# Altium schematic sheet POWER.SchDoc
size B
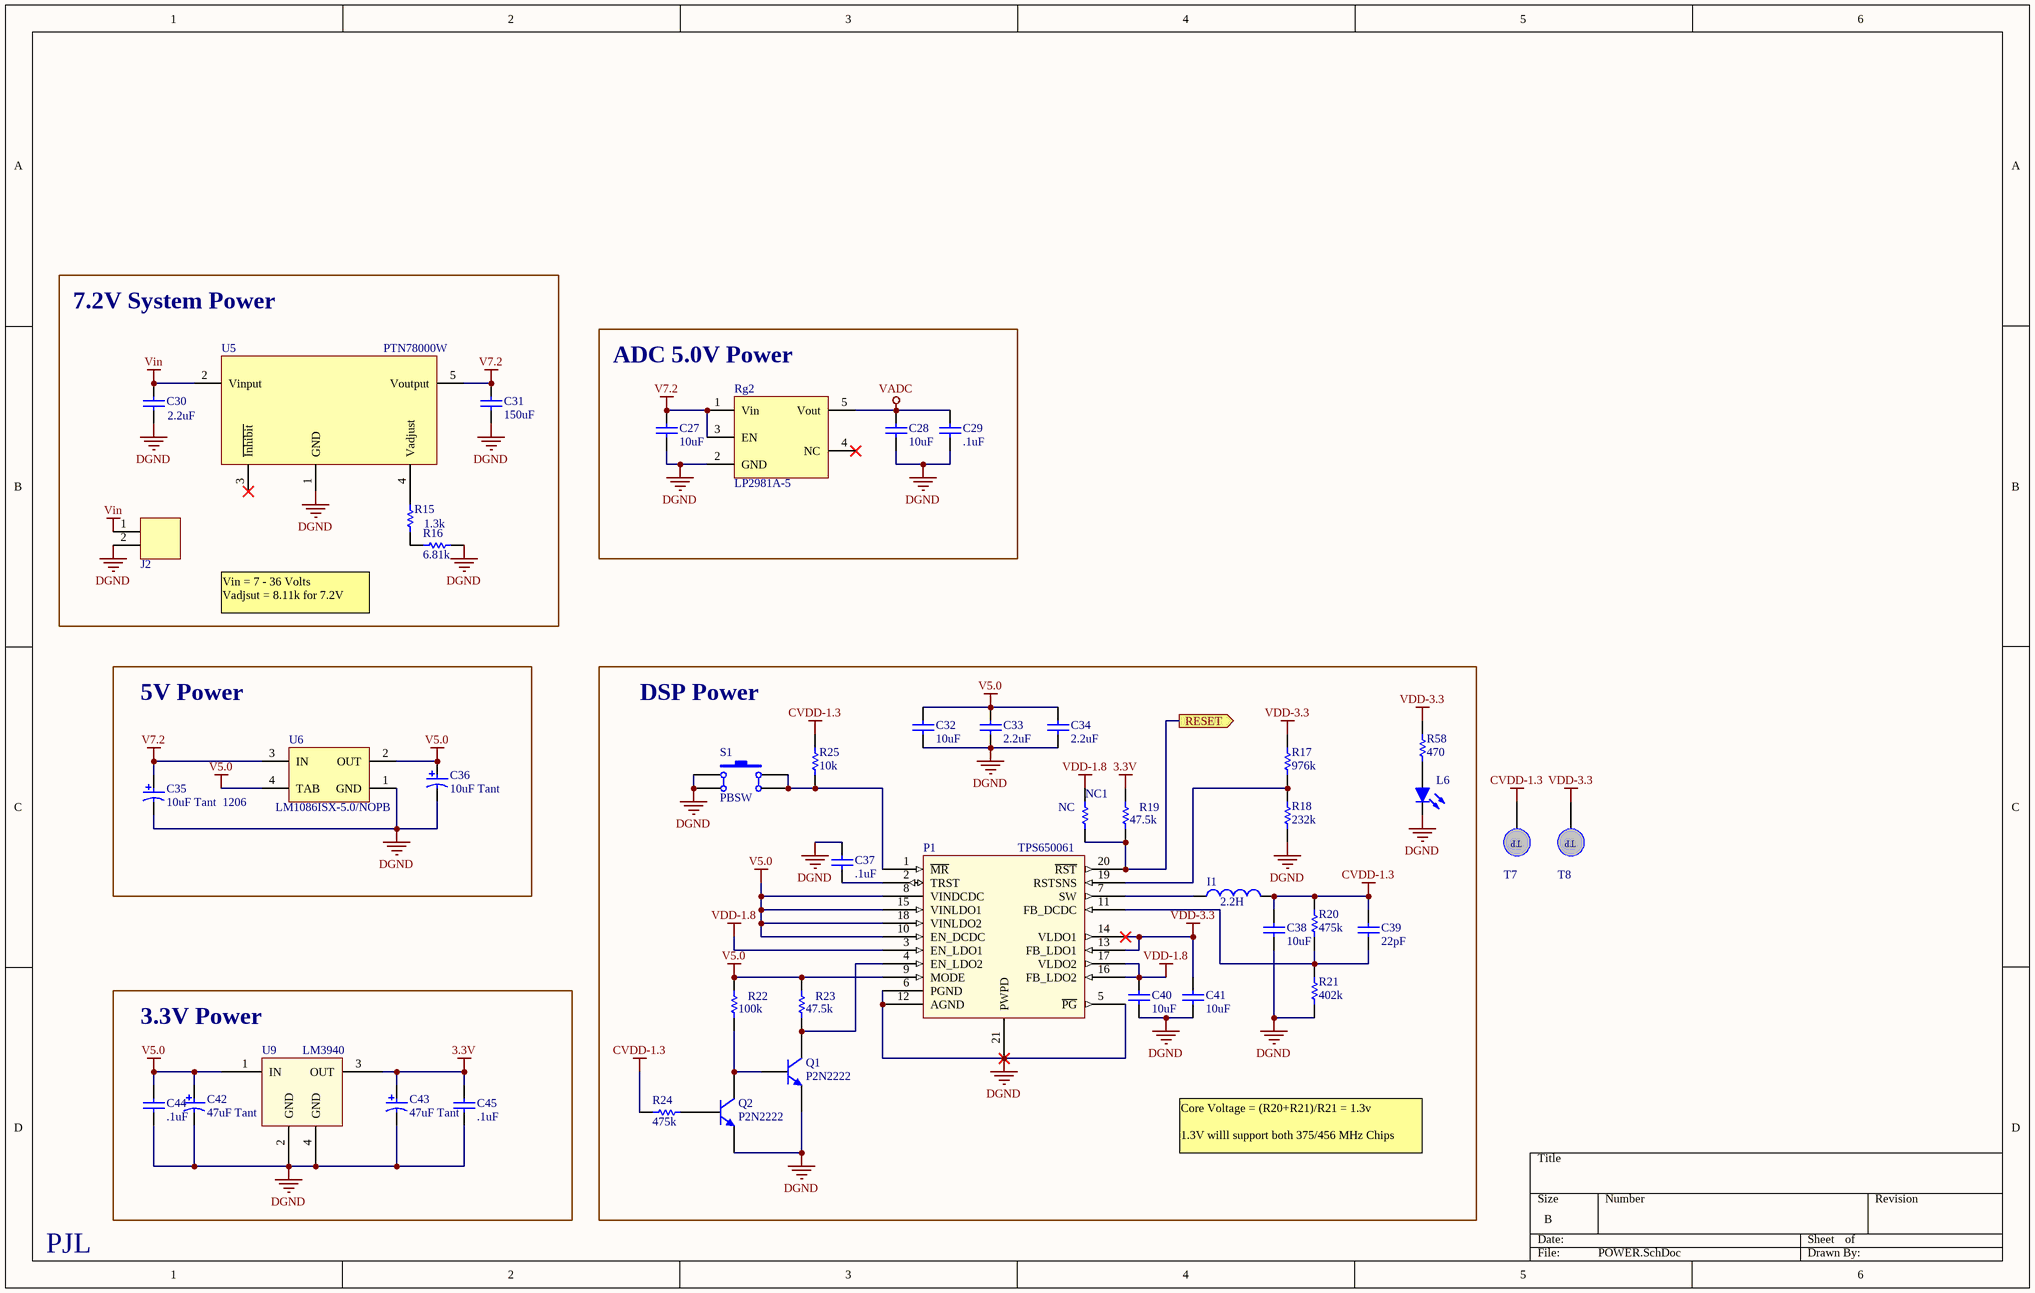
[diagram p0: POWER.SchDoc]

## Parts
C27  10uF  [CAPC2012XL]
C28  10uF  [CAPC2012XL]
C29  .1uF  [CAPC1608XN]
C30  2.2uF  [CAPC2012XL]
C31  150uF  [CAPPR2.5-6.3x11]
C32  10uF  [CAPC2012XL]
C33  2.2uF  [CAPC1608XN]
C34  2.2uF  [CAPC1608XN]
C35  10uF Tant  1206  [CAPMP3216XN]
C36  10uF Tant  [CAPMP2012XL]
C37  .1uF  [CAPC1608XN]
C38  10uF  [CAPC2012XL]
C39  22pF  [CAPC1608XN]
C40  10uF  [CAPC2012XL]
C41  10uF  [CAPC2012XL]
C42  47uF Tant  [CAPMP2012XL]
C43  47uF Tant  [CAPMP2012XL]
C44  .1uF  [CAPC1608XN]
C45  .1uF  [CAPC1608XN]
I1  2.2H  [LPS3015]
J2  2-pin Horz Sherlock  [MOLEX-HDR-1X2-SHERLOCK-HORZ]  (value not drawn)
L6  LED-GREEN  [LED0805-GREEN]  (value not drawn)
NC1  NC  [RESC1608XN]
P1  TPS650061  [QFN4-20N]
Q1  P2N2222  [TO-92A]
Q2  P2N2222  [TO-92A]
R15  1.3k  [RESC1608XL]
R16  6.81k  [RESC1608XL]
R17  976k  [RESC1608XL]
R18  232k  [RESC1608XL]
R19  47.5k  [RESC1608XN]
R20  475k  [RESC1608XL]
R21  402k  [RESC1608XL]
R22  100k  [RESC1608XL]
R23  47.5k  [RESC1608XN]
R24  475k  [RESC1608XL]
R25  10k  [RESC1608XL]
R58  470  [RESC1608XN]
Rg2  LP2981A-5  [TI-SOT-23_5N]
S1  PBSW  [PBSW]
T7  TEST MINI  [TEST-POINT - 5015]  (value not drawn)
T8  TEST MINI  [TEST-POINT - 5015]  (value not drawn)
U5  PTN78000W  [TI-EUS - 3d]
U6  LM1086ISX-5.0/NOPB  [TO263]
U9  LM3940  [SOT230P700X155-4N]

## Blocks framed on the sheet
7.2V System Power: C30 C31 J2 R15 R16 U5
ADC 5.0V Power: C27-C29 Rg2
5V Power: C35 C36 U6
DSP Power: C32-C34 C37-C41 I1 L6 NC1 P1 Q1 Q2 R17-R25 R58 S1
3.3V Power: C42-C45 U9

## Ports
RESET (out)

## Nets
3.3V: C43.1 C45.2 R19.2 U9.3(OUT)
CVDD-1.3: C38.2 C39.2 I1.2 R20.2 R24.2 R25.2 T7.1
DGND: C27.1 C28.1 C29.1 C30.1 C31.2 C32.1 C33.1 C34.1 C35.2 C36.2 C37.2 C38.1 C40.1 C41.1 C42.2 C43.2 C44.1 C45.1 J2.2 L6.1(K) P1.5(~{PG}) P1.6(PGND) P1.12(AGND) P1.21(PWPD) Q1.3(E) Q2.3(E) R16.1 R18.2 R21.2 Rg2.2(GND) S1.1(A) S1.2(A') U5.1(GND) U6.1(GND) U9.2(GND) U9.4(GND)
V5.0: C32.2 C33.2 C34.2 C36.1 C42.1 C44.2 P1.8(VINDCDC) P1.9(MODE) P1.10(EN_DCDC) P1.15(VINLDO1) P1.18(VINLDO2) R22.2 R23.2 U6.2(OUT) U6.4(TAB) U9.1(IN)
V7.2: C27.2 C31.1 C35.1 Rg2.1(Vin) Rg2.3(EN) U5.5(Voutput) U6.3(IN)
VADC: C28.2 C29.2 Rg2.5(Vout)
VDD-1.8: C40.2 NC1.2 P1.3(EN_LDO1) P1.16(FB_LDO2) P1.17(VLDO2)
VDD-3.3: C41.2 P1.13(FB_LDO1) P1.14(VLDO1) R17.1 R58.2 T8.1
Vin: C30.2 J2.1 U5.2(Vinput)
RESET: NC1.1 P1.20(~{RST}) R19.1 ; port RESET
NetC37_1: C37.1 P1.2(TRST)
NetC39_1: C39.1 P1.11(FB_DCDC) R20.1 R21.1
NetI1_1: I1.1 P1.7(SW)
NetL6_2: L6.2(A) R58.1
NetP1_1: P1.1(~{MR}) R25.1 S1.3(B) S1.4(B')
NetP1_4: P1.4(EN_LDO2) Q1.1(C) R23.1
NetP1_19: P1.19(RSTSNS) R17.2 R18.1
NetQ1_2: Q1.2(B) Q2.1(C) R22.1
NetQ2_2: Q2.2(B) R24.1
NetR15_1: R15.1 U5.4(Vadjust)
NetR15_2: R15.2 R16.2

Not connected (* = marked no-connect by the designer): Rg2 4(NC)*; U5 3(~{Inhibit})*

## Notes on the sheet
- Vin = 7 - 36 Volts
  Vadjsut = 8.11k for 7.2V
- Core Voltage = (R20+R21)/R21 = 1.3v
  1.3V willl support both 375/456 MHz Chips
- PJL
- (in symbol TEST-POINT) TP

## Library data of the parts
C27 C28 C32 C38 C40 C41 = CAP-CERAMIC-NP: CAP CER 10UF 10V 10% X7R 0805; Manufacturer: Murata Electronics North America; Manufacturer Part Number: GRM21BR71A106KE51L; Capacitance: 10µF; Tolerance: ±10%; Operating Temperature: -55°C ~ 125°C; Supplier Part Number: 490-3905-1-ND; Supplier: Digi-Key; Voltage - Rated: 10V; Package / Case: 0805 (2012 Metric)
C29 C44 C45 = CAP-CERAMIC-NP: CAP CER 0.1UF 10V 20% X7R 0603; Manufacturer Part Number: CX0603MRX7R6BB104; Manufacturer: Yageo; Capacitance: 0.1µF; Applications: Bypass, Decoupling; Operating Temperature: -55°C ~ 125°C; Tolerance: ±20%; Package / Case: 0603 (1608 Metric); Voltage - Rated: 10V; Temperature Coefficient: X7R; Supplier Part Number: 311-1237-1-ND; Supplier: Digi-Key
C30 = Capacitor: Non Polarized Capacitor 2.2uF; Manufacturer: TDK Corporation; Manufacturer Part Number: C2012X5R1H225K; Value: 2.2uF; Supplier: DigiKey; Supplier Part Number: 445-5976-1-ND
C31 = Capacitor: CAP ALUM 150UF 25V 20% RADIAL; Manufacturer: Panasonic Electronic Components; Manufacturer Part Number: EEU-FR1E151; Capacitance: 150µF; Supplier Part Number: P14414-ND; Supplier: Digi-Key; Tolerance: ±20%; Package / Case: Radial, Can; Lead Spacing: 0.098" (2.50mm); Height - Seated (Max): 0.441" (11.20mm); Size / Dimension: 0.248" Dia (6.30mm); Voltage Rating: 25V
C33 C34 = CAP-CERAMIC-NP: CAP CER 2.2UF 10V 10% X5R 0603; Manufacturer: Murata Electronics North America; Manufacturer Part Number: GRM188R61A225KE34D; Capacitance: 2.2µF; Tolerance: ±10%; Package / Case: 0603 (1608 Metric); Voltage - Rated: 10V; Temperature Coefficient: X5R; Supplier: Digi-Key; Supplier Part Number: 490-1545-1-ND
C35 = CAP-TANT: Capacitor, Tantalum, Polarized; Manufacturer: Vishay Sprague; Manufacturer Size Code: A; Manufacturer Part Number: 293D106X9016A2TE3; ESR (Equivalent Series Resistance): 3 Ohm; Tolerance: ±10%; Capacitance: 10µF; Voltage - Rated: 16V; Description: CAP TANT 10UF 16V 10% 1206; Supplier: Digi-Key; Supplier Part Number: 718-1123-2-ND; Package / Case: 1206 (3216 Metric)
C36 = CAP-TANT: Capacitor, Tantalum, Polarized; Manufacturer: AVX Corporation; Manufacturer Part Number: TAJP106M010RNJ; Voltage - Rated: 10V; Capacitance: 10µF; Tolerance: ±20%; Description: CAP TANT 10UF 10V 20% 0805; Supplier: Digi-Key; Package / Case: 0805 (2012 Metric); Supplier Part Number: 478-3281-1-ND
C37 = CAP-CERAMIC-NP: CAP CER 0.1UF 16V 10% X7R 0603; Manufacturer Part Number: GRM188R71C104KA01D; Manufacturer: Murata Electronics North America; Capacitance: 0.1µF; Tolerance: ±10%; Package / Case: 0603 (1608 Metric); Supplier Part Number: 490-1532-1-ND; Supplier: Digi-Key; Voltage - Rated: 16V
C39 = CAP-CERAMIC-NP: CAP CER 22PF 50V 5% NP0 0603; Manufacturer: Murata Electronics North America; Manufacturer Part Number: GRM1885C1H220JA01D; Package / Case: 0603 (1608 Metric); Capacitance: 22pF; Tolerance: ±5%; Voltage - Rated: 50V; Supplier Part Number: 490-1411-1-ND; Supplier: Digi-Key
C42 C43 = CAP-TANT: Capacitor, Tantalum, Polarized; Manufacturer Part Number: TLJR476M010R3200; Manufacturer: AVX Corporation; Description: CAP TANT 47UF 10V 20% 0805; Voltage - Rated: 10V; Tolerance: ±20%; Capacitance: 47µF; Supplier: Digi-Key; Supplier Part Number: 478-5990-1-ND; Package / Case: 0805 (2012 Metric); Features: General Purpose
I1 = VLC5045: Manufacturer: Coilcraft; Manufacturer Part Number: LPS3015-222ML
J2 = MOLEX-HDR-1x2-SHERLOCK_RA: Header, Molex, 2mm Pitch Sherlock Header, Single Row, Horizontal, 2 Circuits, Length 3.3mm,  0353630260; Manufacturer: Molex Inc; Manufacturer Part Number: 0353630260; Supplier Part Number: WM18931-ND; Supplier: Digi-Key
L6 = LED-GREEN: Light Emitting Diode - GREEN; Manufacturer Part Number: LTST-C171GKT; Manufacturer: Lite-On Inc; Description: LED GREEN CLEAR THIN 0805 SMD; Viewing Angle: 130°; Millicandela Rating: 12mcd; Current - Test: 20mA; Voltage - Forward (Vf) Typ: 2.1V; Supplier Part Number: 160-1423-1-ND; Supplier: Digi-Key; Package / Case: 0805 (2012 Metric); Color: Green
NC1 = RES-CHIP: Resistor Chip
P1 = TPS650061: IC CONV STP-DWN 2.25MHZ DL 20QFN; Manufacturer: Texas Instruments; Manufacturer Part Number: TPS650061RUKT; Voltage - Supply: 2.3 V ~ 6 V; Operating Temperature: -40°C ~ 85°C; Package / Case: 20-WFQFN Exposed Pad; Supplier: Digi-Key; Supplier Part Number: 296-25358-1-ND
Q1 Q2 = P2N2222: TRANS GP SS NPN LP 40V TO92; Manufacturer Part Number: P2N2222AG; Manufacturer: ON Semiconductor; Transistor Type: NPN; Voltage - Collector Emitter Breakdown (Max): 40V; Supplier: Digi-Key; Package / Case: TO-226-3, TO-92-3 (TO-226AA); Supplier Part Number: P2N2222AGOS-ND
R15 = Resistor: 1.3k Ohm Resistor; Manufacturer Part Number: RT0603DRD071K3L; Manufacturer: Yageo; Tolerance: ±0.5%; Power (Watts): 0.1W, 1/10W; Description: RES 1.3K OHM 1/10W .5% 0603 SMD; Resistance (Ohms): 1.3k; Supplier Part Number: 311-1.3KDCT-ND; Package / Case: 0603 (1608 Metric); Supplier: Digi-Key
R16 = Resistor: Resistor 6.81k; Manufacturer: Yageo; Manufacturer Part Number: RT0603DRD076K81L; Power (Watts): 0.1W, 1/10W; Tolerance: ±0.5%; Description: RES 6.81K OHM 1/10W .5% 0603 SMD; Supplier Part Number: 311-6.81KDCT-ND; Resistance (Ohms): 6.81k; Supplier: Digi-Key; Package / Case: 0603 (1608 Metric)
R17 = RES-CHIP: Resistor Chip; Manufacturer Part Number: RC0603FR-07976KL; Manufacturer: Yageo; Power (Watts): 0.1W, 1/10W; Tolerance: ±1%; Description: RES 976K OHM 1/10W 1% 0603 SMD; Resistance (Ohms): 976k; Package / Case: 0603 (1608 Metric); Supplier Part Number: 311-976KHRCT-ND; Supplier: Digi-Key
R18 = RES-CHIP: Resistor Chip; Manufacturer Part Number: CRCW0603232KFKEA; Manufacturer: Vishay Dale; Tolerance: ±1%; Power (Watts): 0.1W, 1/10W; Description: RES 232K OHM 1/10W 1% 0603 SMD; Package / Case: 0603 (1608 Metric); Resistance (Ohms): 232k; Supplier Part Number: 541-232KHTR-ND; Supplier: Digi-Key
R19 R23 = RES-CHIP: Resistor Chip; Manufacturer: TE Connectivity; Manufacturer Part Number: 2-1879338-5; Description: RES 47.5K OHM 1/16W 1% 0603; Tolerance: ±1%; Power (Watts): 0.063W, 1/16W; Supplier Part Number: A102279CT-ND; Supplier: Digi-Key; Package / Case: 0603 (1608 Metric); Resistance (Ohms): 47.5k
R20 R24 = RES-CHIP: Resistor Chip; Manufacturer: Yageo; Manufacturer Part Number: RC0603FR-07475KL; Tolerance: ±1%; Power (Watts): 0.1W, 1/10W; Description: RES 475K OHM 1/10W 1% 0603 SMD; Package / Case: 0603 (1608 Metric); Resistance (Ohms): 475k; Supplier: Digi-Key; Supplier Part Number: 311-475KHRTR-ND
R21 = RES-CHIP: RES 402K OHM 1/10W 1% 0603 SMD; Manufacturer: Yageo; Manufacturer Part Number: RC0603FR-07402KL; Power (Watts): 0.1W, 1/10W; Supplier: Digi-Key; Package / Case: 0603 (1608 Metric); Tolerance: ±1%; Resistance (Ohms): 402k; Supplier Part Number: 311-402KHRCT-ND
R22 = RES-CHIP: RES 100K OHM 1/10W 1% 0603 SMD; Manufacturer Part Number: RC0603FR-07100KL; Manufacturer: Yageo; Power (Watts): 0.1W, 1/10W; Supplier Part Number: 311-100KHRTR-ND; Supplier: Digi-Key; Resistance (Ohms): 100k; Tolerance: ±1%; Package / Case: 0603 (1608 Metric)
R25 = RES-CHIP: Resistor Chip; Manufacturer: Yageo; Manufacturer Part Number: RC0603JR-0710KL; Description: RES 10K OHM 1/10W 5% 0603 SMD; Tolerance: ±5%; Power (Watts): 0.1W, 1/10W; Supplier Part Number: 311-10KGRCT-ND; Supplier: Digi-Key; Package / Case: 0603 (1608 Metric); Resistance (Ohms): 10k
R58 = RES-CHIP: RES 470 OHM .25W 5% 0603 SMD; Manufacturer: Vishay Dale; Manufacturer Part Number: CRCW0603470RJNEAHP; Power (Watts): 0.25W, 1/4W; Supplier Part Number: 541-470SACT-ND; Supplier: Digi-Key; Resistance (Ohms): 470; Package / Case: 0603 (1608 Metric); Tolerance: ±5%
Rg2 = LP2981A: 100mA 5v LDO - 0.75% accuracy; Manufacturer: Texas Instruments; Manufacturer Part Number: LP2981A-50DBVT; Description: IC REG LDO 5V .1A SOT23-5; Voltage - Input: Up to 16V; Current - Output: 100mA (Max); Voltage - Dropout (Typical): 0.2V @ 100mA; Supplier Part Number: 296-32146-1-ND; Supplier: Digi-Key; Operating Temperature: -40°C ~ 125°C; Supplier Device Package: SOT-23-5; Voltage - Output: 5V
S1 = SW-PB: Push Button Switch; Manufacturer: Panasonic Electronic Components; Manufacturer Part Number: EVQ-9P105M; Description: SWITCH TACTILE SPST-NO 0.05A 12V; Outline: 6.10mm x 6.00mm; Actuator Orientation: Top Actuated; Actuator Height off PCB, from Pins: 5.00mm; Published: 24-Mar-1999; LatestRevisionDate: 17-Jul-2002; LatestRevisionNote: Re-released for DXP Platform.; PackageReference: SPST-2; Publisher: Altium Limited; PackageDescription: Switch; 2 Leads; Supplier: Digi-Key; Supplier Part Number: P13586SCT-ND
T7 T8 = TEST-POINT: PC TEST POINT MINIATURE SMT; Manufacturer: Keystone Electronics; Manufacturer Part Number: 5015; Supplier: Digi-Key; Supplier Part Number: 5015KDKR-ND
U5 = PTN78000W: 1.5A, 7-36V Input, Variable Switching Voltage Regulator; Manufacturer Part Number: PTN78000WAH; Order Part Number: 296-20506-ND; Manufacturer: Texas Instruments; Description: REG SW 2.5-12.6V 1.5A HORZ T/H; Voltage - Input (Max): 36V; Voltage - Input (Min): 7V; Voltage - Output 1: 2.5 ~ 12.6 V; Efficiency: 91%; Supplier: Digi-Key; Current - Output (Max): 1.5A; Supplier Part Number: 296-20506-ND
U6 = LM1086ISX-5.0/NOPB: 1.5A Low Dropout Positive Regulators, 3-pin TO-263, Pb-Free; Manufacturer: National Semiconductor; Voltage - Dropout (Typical): 1.3V @ 1.5A; Voltage - Input: Up to 25V; Voltage - Output: 5V; Description: IC REG LDO 5V 1.5A TO-263; Manufacturer Part Number: LM1086ISX-5.0/NOPB; Current - Output: 1.5A; Supplier: Digi-Key; Package / Case: TO-263-4, D²Pak (3 Leads + Tab), TO-263AA; Supplier Device Package: TO-263-3; Supplier Part Number: LM1086IS-5.0-ND
U9 = LM3940: 3.3V Regulator from a 5V Supply; Manufacturer: National Semiconductor; Manufacturer Part Number: LM3940IMP-3.3/NOPB; Current - Output: 1A; Description: IC REG LDO 3.3V 1A SOT-223; Voltage - Input: Up to 7.5V; Voltage - Dropout (Typical): 0.5V @ 1A; Package / Case: TO-261-4, TO-261AA; Supplier Part Number: LM3940IMP-3.3CT-ND; Voltage - Output: 3.3V; Supplier: Digi-Key